# EAGLE design LB_BIT_o5_DCMOTOR-v02(rev1) (EAGLE 6.6.0)
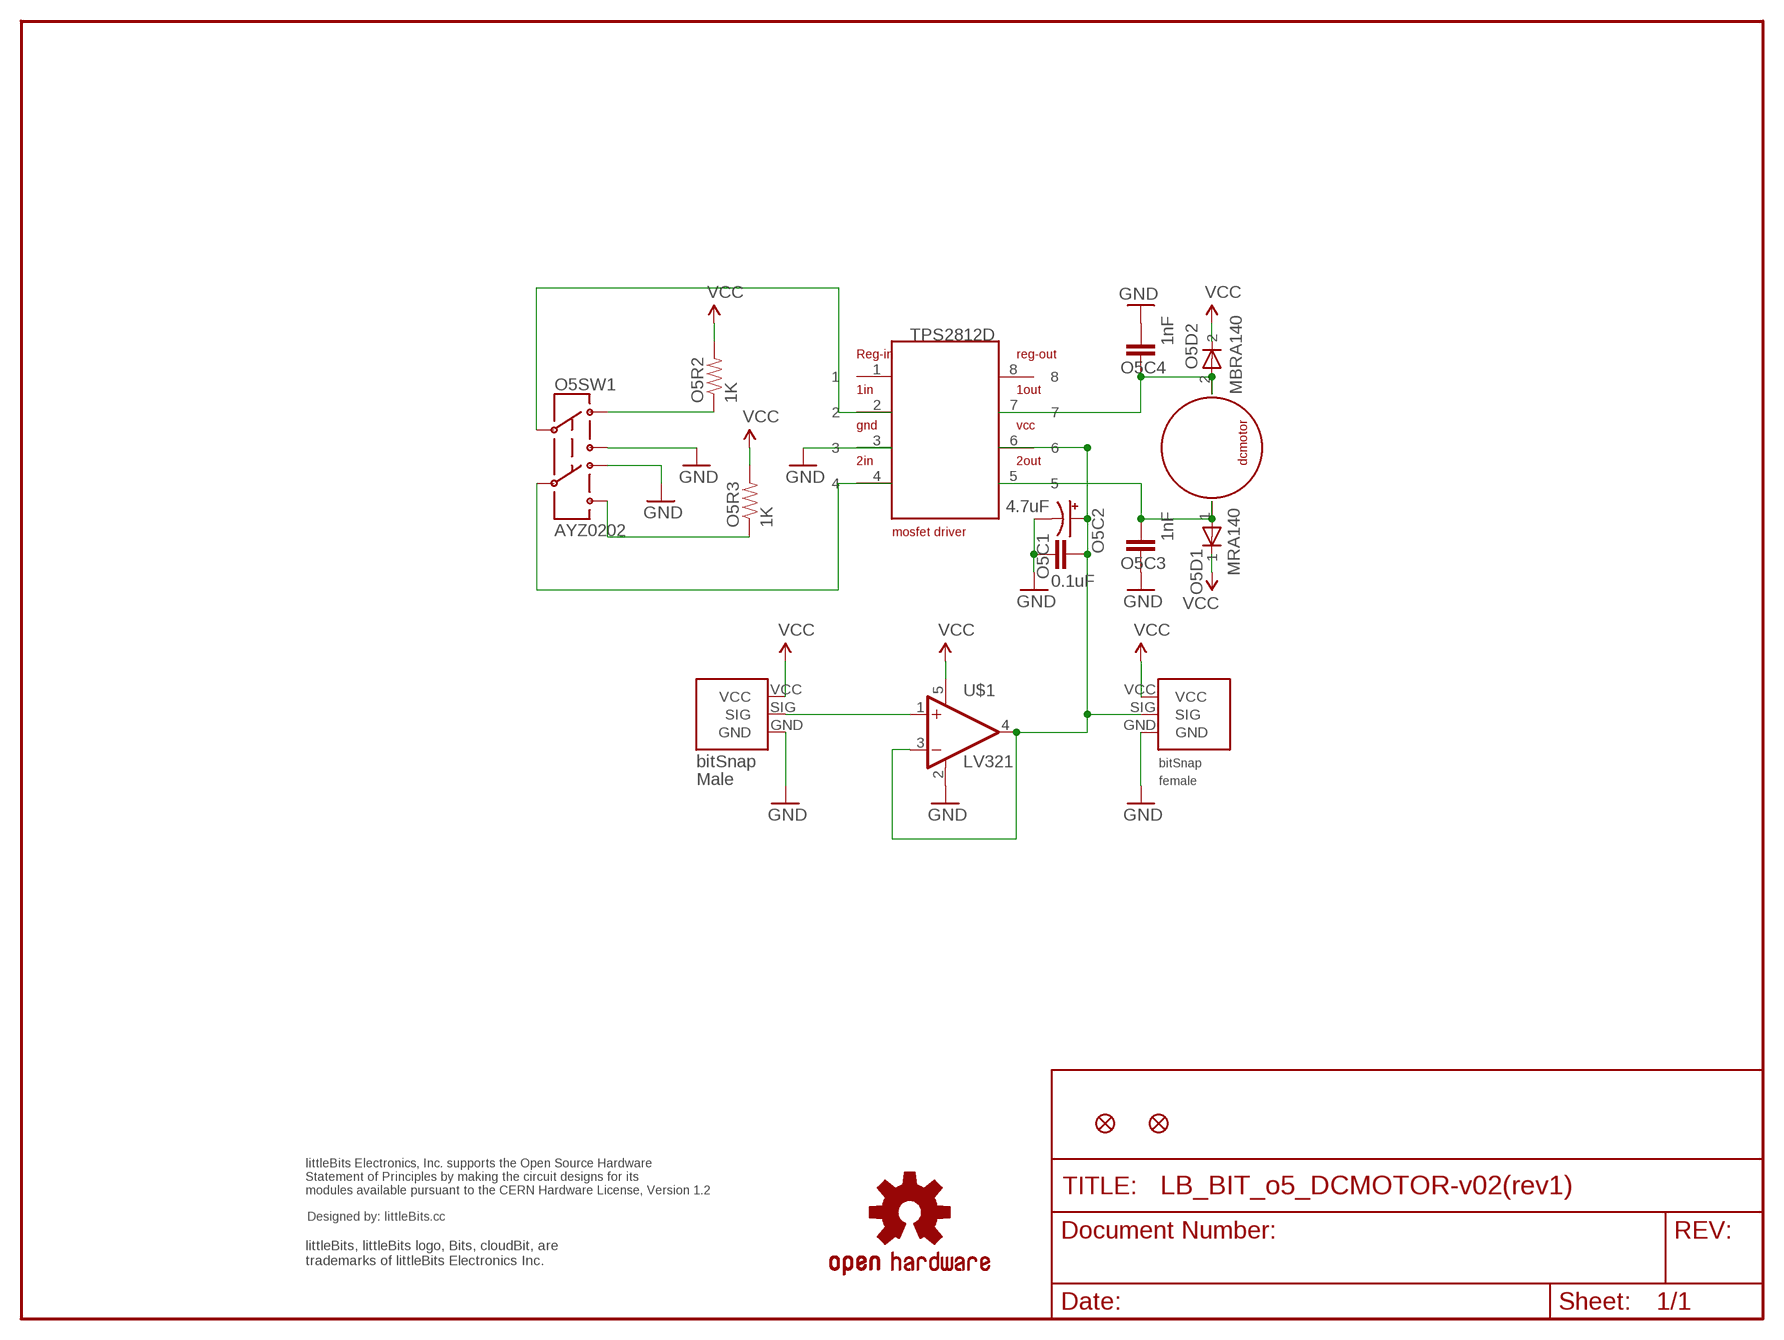
[diagram p0: schematic, sheet 1]

## Parts
JP1  FIDUCIAL1X2  [FIDUCIAL-1X2]
JP2  FIDUCIAL1X2  [FIDUCIAL-1X2]
O5BSF  BITSNAP_FEMALE  [BITSNAP_FEMALE]
O5BSM  BITSNAP_MALE  [BITSNAP_MALE]
O5C1  0.1uF  CAP0603-CAP  [0603-CAP]
O5C2  4.7uF  CAP_POL1206  [EIA3216]
O5C3  1nF  CAP0603-CAP  [0603-CAP]
O5C4  1nF  CAP0603-CAP  [0603-CAP]
O5D1  MRA140  DIODESMA  [SMA-DIODE]
O5D2  MBRA140  DIODESMA  [SMA-DIODE]
O5M1  DCMOTOR  [MOTOR-DC]
O5R2  1K  RESISTOR0603-RES  [0603-RES]
O5R3  1K  RESISTOR0603-RES  [0603-RES]
O5SW1  AYZ0202  [AYZ0202]
O5U1  TPS2812-SOIC8  [TPS2812]
U$1  LV321  [SC70-5]
U$4  OSHW-LOGOL  [OSHW-LOGO-L]
U$6  OSHWCREDIT  [OSHWCREDIT]

## Nets
GND: O5BSF.GND O5BSM.GND O5C1.1 O5C2.C(-) O5C3.1 O5C4.2 O5SW1.1 O5SW1.6 O5U1.3 U$1.2(V-)
N$1: O5BSM.SIG U$1.1(+IN)
N$4: O5R2.1 O5SW1.3
N$5: O5R3.1 O5SW1.4
N$7: O5SW1.5 O5U1.4
N$8: O5SW1.2 O5U1.2
N$9: O5C4.1 O5D2.A O5M1.2 O5U1.7
N$10: O5C3.2 O5D1.A O5M1.1 O5U1.5
SIG: O5BSF.SIG O5C1.2 O5C2.A(+) O5U1.6 U$1.3(-IN) U$1.4(OUT)
VCC: O5BSF.VCC O5BSM.VCC O5D1.C O5D2.C O5R2.2 O5R3.2 U$1.5(V+)
Unconnected: O5U1.1 O5U1.8

## Notes on the sheet
- TPS2812D

## Library data of the parts
JP1 JP2 = SparkFun:FIDUCIAL: Fiducial Alignment Points Various fiducial points for machine vision alignment.
O5BSF = bitSnap:BITSNAP_FEMALE
O5BSM = bitSnap:BITSNAP_MALE
O5C1 O5C3 O5C4 = SparkFun:CAP: Capacitor Standard 0603 ceramic capacitor, and 0.1" leaded capacitor.
O5C2 = SparkFun:CAP_POL: Capacitor Polarized These are standard SMD and PTH capacitors. Normally 10uF, 47uF, and 100uF in electrolytic and tantalum varieties. Always verify the external diameter of the through hole cap, it varies with capacity, voltage, and manufacturer. The EIA devices should be standard.
O5D1 O5D2 = LITTLEBITS:DIODE: Diode These are standard reverse protection diodes and small signal diodes. SMA package can handle up to about 1A. SOD-323 can handle about 200mA. What the SOD-323 package when ordering, there are some mfgs out there that are 5-pin packages.
O5M1 = LITTLEBITS:DCMOTOR
O5R2 O5R3 = SparkFun:RESISTOR: Resistor Basic schematic elements and footprints for 0603, 1206, and PTH 1/10th watt (small) resistors.
O5SW1 = SparkFun:AYZ0202: SPDT Slide Switch Simple SMD single-pull double-throw slide switch. Good for less than 350mA power switch, switching UARTs between devices, etc. Spark Fun Electronics SKU : COM-00597
O5U1 = LITTLEBITS:TPS2812-SOIC8
U$1 = LITTLEBITS:LV321
U$4 = SparkFun_NEW:OSHW-LOGO: Open Source Hardware Logo This logo indicates the piece of hardware it is found on incorporates a OSHW license and/or adheres to the definition of open source hardware found here: http://freedomdefined.org/OSHW
U$6 = LITTLEBITS:OSHWCREDIT

## Board
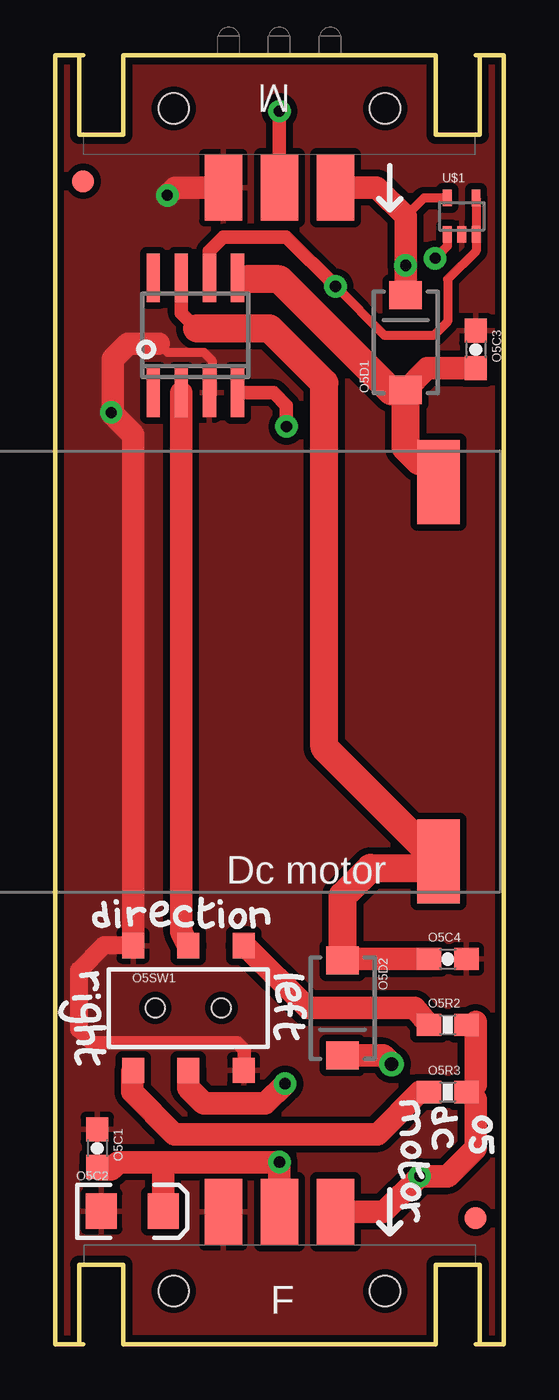
[diagram p1: board, top side]
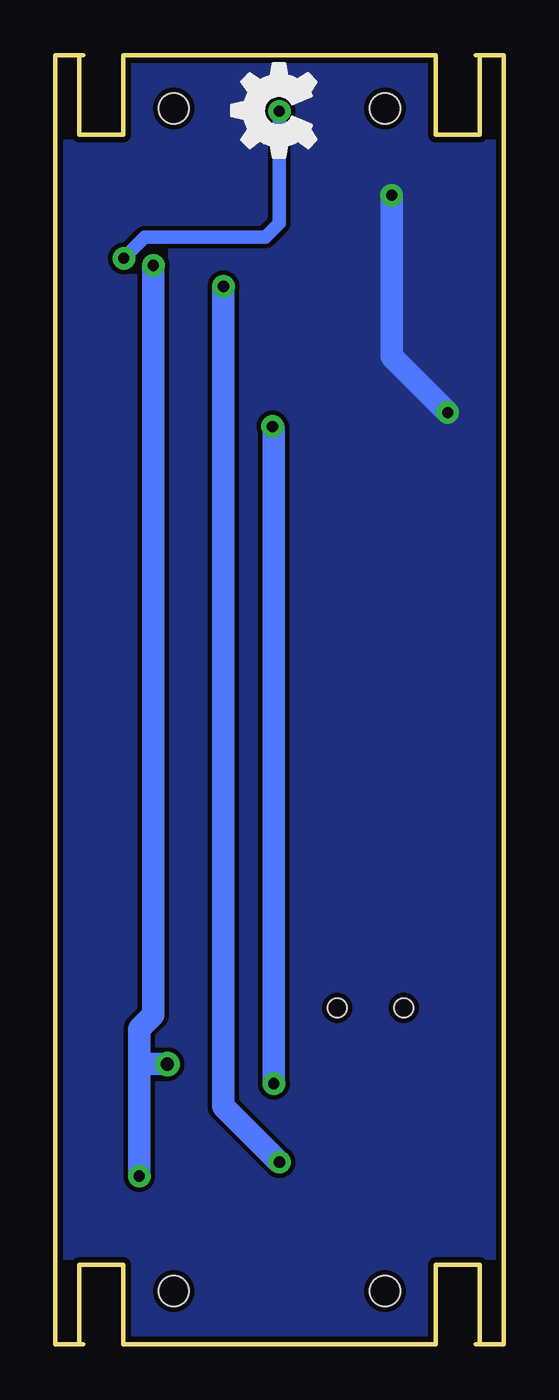
[diagram p2: board, bottom side, seen from below]

Size 20.32 x 58.42 mm. Coordinates in mm from the lower left corner, seen from the top.
Outline: 1.27,58.42 0,58.42 0,0 1.27,0
Outline: 19.05,58.42 20.32,58.42 20.32,0 19.05,0
Copper layers (1*16): Top 0.035mm / dielectric 1.5mm / Bottom 0.035mm
Design rules "default": minimum track width 8mil, minimum drill 20mil, track to track 8mil, track to pad 8mil, pad to pad 8mil, via to via 8mil, smd to smd 8mil, copper to edge 10mil, drill to drill 8mil, minimum pad ring 12mil, minimum via ring 10mil, stop-mask expansion 4mil, vias tented up to drill 25mil, thermal gap 10mil

### Footprints (pad centres in the part's own frame; a part is rotated, then mirrored left to right if it is on the bottom)
FIDUCIAL-1X2 = smd 1 x 1: 1 0,0
BITSNAP_FEMALE = smd 1.7 x 3: GND 6.35,6; SIG 8.89,6; VCC 11.43,6 | hole 1.37: 13.68,2.41; 4.1,2.41
BITSNAP_MALE = smd 1.7 x 3: GND 11.43,6; SIG 8.89,6; VCC 6.35,6 | hole 1.37: 13.68,2.41; 4.1,2.41
0603-CAP = smd 1.1 x 1: 1 -0.85,0; 2 0.85,0
EIA3216 = smd 1.4 x 1.6: A 1.4,0; C -1.4,0
SMA-DIODE = smd 1.27 x 1.47: A -2.15,0; C 2.15,0
MOTOR-DC = smd 1.93 x 3.81: 1 7.2,8.6; 2 7.2,-8.6
0603-RES = smd 1.1 x 1: 1 -0.85,0; 2 0.85,0
AYZ0202 = smd 1 x 1.15: 1 -2.5,2.825; 2 0,2.825; 3 2.5,2.825; 4 -2.5,-2.825; 5 0,-2.825; 6 2.5,-2.825 | hole 0.85: 1.5,0; -1.5,0
TPS2812 = smd 0.6 x 2.2: 1 -1.905,-2.6; 2 -0.635,-2.6; 3 0.635,-2.6; 4 1.905,-2.6; 5 1.905,2.6; 6 0.635,2.6; 7 -0.635,2.6; 8 -1.905,2.6
SC70-5 = smd 0.4 x 0.75: 1 -0.65,-0.825; 2 0,-0.825; 3 0.65,-0.825; 4 0.65,0.825; 5 -0.65,0.825

### Placement (x,y rotation side)
JP1  19.05,5.71 0 top
JP2  1.27,52.7 0 top
O5BSF  1.27,0 0 top
O5BSM  19.05,58.42 180 top
O5C1  1.91,8.89 270 top
O5C2  3.49,6.03 0 top
O5C3  19.05,45.09 270 top
O5C4  17.78,17.46 0 top
O5D1  15.88,45.4 90 top
O5D2  13.02,15.24 270 top
O5M1  10.16,30.48 0 top
O5R2  17.78,14.48 0 top
O5R3  17.78,11.43 0 top
O5SW1  6.03,15.24 0 top
O5U1  6.35,45.72 0 top
U$1  18.41,51.12 0 top
U$2  [O]  18.8,10.54 270 top
U$3  [5]  18.48,9.59 270 top
U$4  -12.7,-11.43 0 top  (outside the outline)
U$5  [D]  16.89,10.86 270 top
U$6  -16.51,-24.13 0 top  (outside the outline)
U$8  [OSHW_FILLX150_NOTEXT]  8.51,52.96 0 top
U$36  [C]  16.89,9.91 270 top
U$37  [M]  15.56,11.3 270 top
U$38  [O]  15.56,9.4 270 top
U$39  [T]  15.43,8.45 270 top
U$40  [O]  15.56,7.49 270 top
U$41  [R]  15.43,6.67 270 top
U$42  [D]  1.59,18.73 0 top
U$43  [I]  2.54,18.73 0 top
U$44  [R]  2.98,18.73 0 top
U$45  [E]  4.06,18.73 0 top
U$46  [C]  5.21,18.73 0 top
U$47  [T]  6.29,18.73 0 top
U$48  [I]  7.24,18.73 0 top
U$49  [O]  7.68,18.73 0 top
U$50  [N]  8.76,18.8 0 top
U$51  [L]  9.78,16.89 270 top
U$52  [E]  9.78,16.64 270 top
U$53  [E]  9.78,16.64 270 top
U$54  [F]  9.78,15.62 270 top
U$55  [T]  9.78,14.73 270 top
U$56  [R]  0.89,17.14 270 top
U$57  [I]  0.64,16 270 top
U$58  [G]  0.13,15.75 270 top
U$59  [H]  0.64,14.48 270 top
U$60  [T]  0.76,13.59 270 top

### Tracks (layer width: path | path; a pad name or v marks a point on that pad's centre or on a via)
GND  (via drill 0.51)
  Top 0.406: 8.57,12.46 O5SW1.6 | 7.11,42.99 7.11,44.58 6.73,44.96 5.08,44.96 4.7,45.34
  Top 0.61: 8.57,12.46 8.57,13.34 8.26,13.65 1.59,13.65 1.08,14.16 1.08,14.29
  Top 0.813: 1.08,14.29 1.08,16.95 2.22,18.1 3.5,18.1 O5SW1.1
  Top 1.016: 4.7,45.34 3.3,45.34 2.6,44.64 2.6,42.29 v2.54,42.23 3.53,41.23 O5SW1.1 | O5BSM.GND 5.43,52.42 v5.08,52.07
  Bottom 1.016: v5.08,52.07 5.08,44.77 v2.54,42.23
  pour Top (isolate 0.305): 0,0 0,58.42 20.32,58.42 20.32,0
  pour Bottom: 0.32,58.1 20,58.1 20,54.93 20,0.32 0.32,0.32 0.32,11.43
N$1  (via drill 0.5)
  Top 0.406: U$1.1 17.77,49.77 v17.21,49.21
  Top 0.61: v10.16,55.88 O5BSM.SIG
  Bottom 0.61: v17.21,49.21 16.26,50.16 10.79,50.16 10.16,50.8 v10.16,55.88
N$4
  Top 1.016: O5SW1.3 8.61,18.07 11.43,15.24 16.3,15.24 O5R2.1
N$5
  Top 0.406: 16.51,11.43 O5R3.1 | O5SW1.4 3.49,12.38
  Top 1.016: 16.51,11.43 14.61,9.53 5.4,9.53 3.49,11.43 3.49,12.38
N$7  (via drill 0.51)
  Top 0.406: v10.48,41.59 10.42,41.59
  Top 0.61: O5U1.4 9.9,43.12 10.48,42.55 v10.48,41.59
  Top 1.016: O5SW1.5 6.03,11.62 6.73,10.92 9.53,10.92 v10.41,11.81
  Bottom 0.406: 10.41,41.53 v10.48,41.59
  Bottom 1.016: v10.41,11.81 10.41,41.53
N$8
  Top 1.016: O5U1.2 5.71,18.7 O5SW1.2
N$9
  Top 0.61: O5U1.7 5.71,46.74 6.41,46.04
  Top 1.016: 17.07,21.59 O5M1.2 | O5C4.1 12.77,17.46 O5D2.A
  Top 1.27: 6.41,46.04 9.72,46.04 12.19,43.56 12.19,27.05 O5M1.2 | O5D2.A 13.02,20.32 14.29,21.59 17.07,21.59
N$10
  Top 0.406: 8.63,48.26 O5U1.5
  Top 1.016: O5M1.1 17.36,39.79 16.51,40.01 | 15.8,43.18 O5D1.A 16.86,44.23 O5C3.2
  Top 1.27: 8.63,48.26 10.16,48.26 15.24,43.18 15.8,43.18 | O5D1.A 15.88,40.64 16.51,40.01
SIG  (via drill 0.51)
  Top 0.406: v12.7,47.94 14.92,45.72 17.14,45.72 17.78,46.35 17.78,48.26 19.07,49.55 U$1.3 U$1.4
  Top 0.61: v12.7,47.94 10.48,50.16 7.62,50.16 6.99,49.53 O5U1.6
  Top 1.016: O5BSF.SIG v10.16,8.26 4.76,8.26 | 4.76,8.26 2.86,8.26 2.54,7.94 2.01,7.94 O5C1.2 | O5C2.A 4.89,8.12 4.76,8.26
  Bottom 1.016: v10.16,8.26 12.7,10.79 v12.7,47.94
VCC  (via drill 0.51, 0.6)
  Top 0.406: 19.05,11.75 O5R3.2 19.05,11.11 | 19.05,14.61 O5R2.2 | U$1.5 16.7,51.94 15.88,51.12
  Top 1.016: 19.05,11.75 19.05,14.61 | 19.05,11.11 19.05,8.89 17.78,7.62 v16.51,7.62 14.89,6 O5BSF.VCC | O5D2.C 14.85,13.09 v15.24,12.7 | O5BSM.VCC 14.57,52.42 15.88,51.12 v15.88,48.9 O5D1.C
  Bottom 1.016: v16.51,7.62 16.51,12.7 | 16.51,12.7 16.51,14.29 15.88,14.92 v15.88,48.9 | 16.51,12.7 v15.24,12.7

### Text on the board
Reference: TPS2812D